# EAGLE schematic edi 1 (EAGLE 9.6.2)
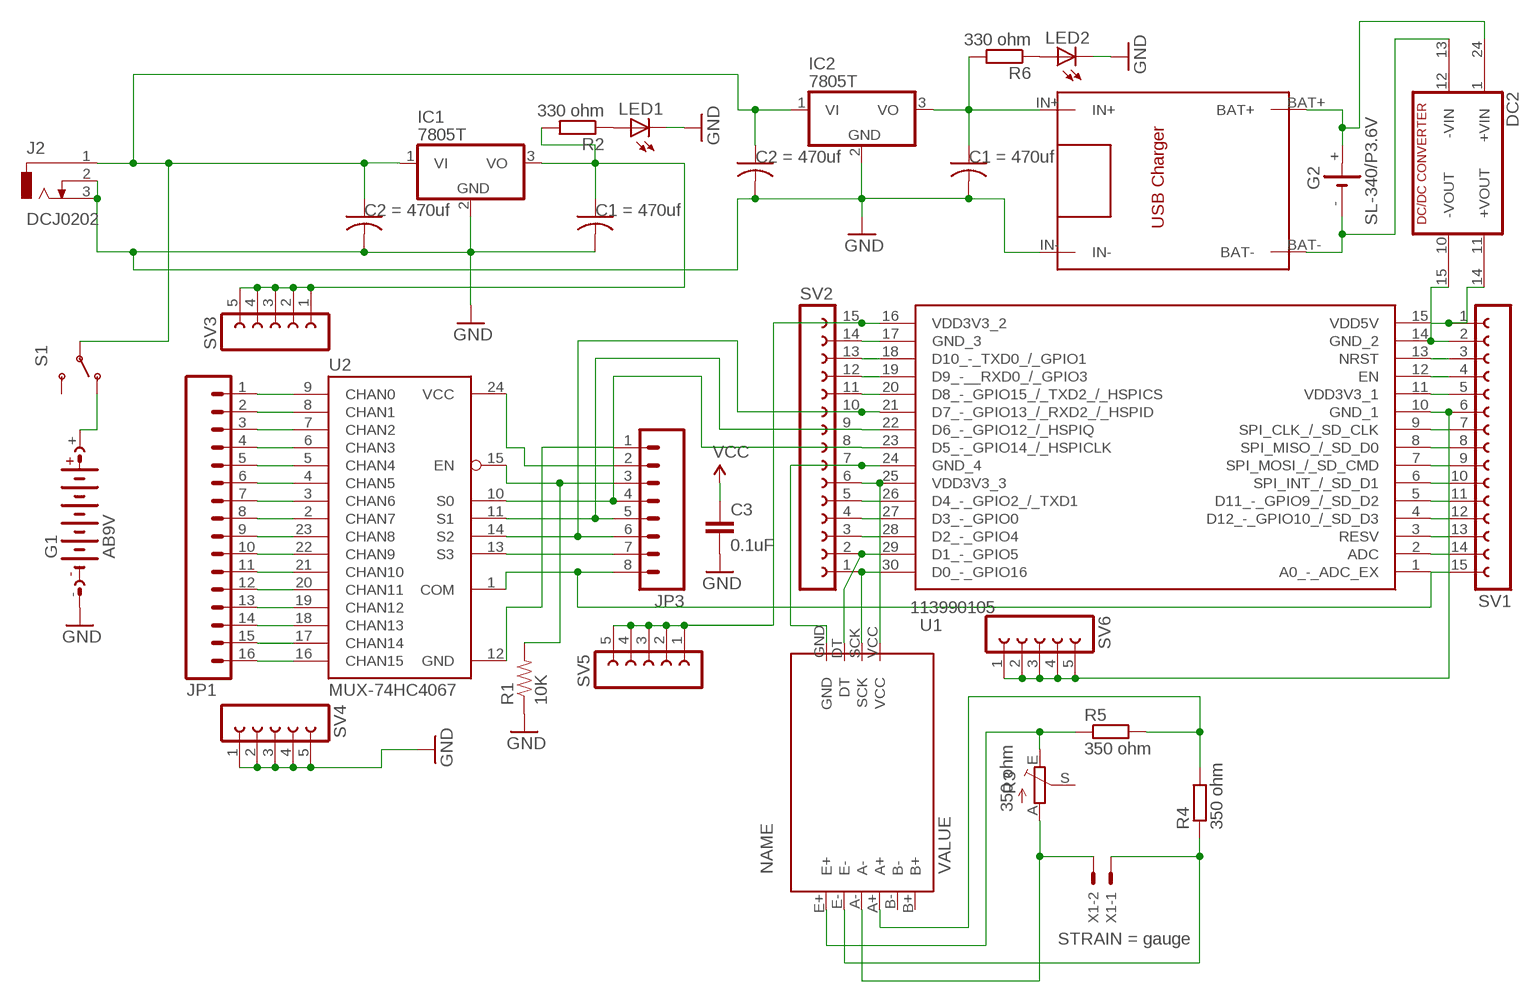
[diagram p0: schematic, sheet 1]

## Parts
C1  C-US025-024X044  [C025-024X044]
C2  C-US025-024X044  [C025-024X044]
C3  0.1uF  CAP0603  [0603]
C4  C-US025-024X044  [C025-024X044]
C5  C-US025-024X044  [C025-024X044]
DC2  DC213R  [CMK]
G1  AB9V  [AB9V]
G2  SL-340/P3.6V  [SL-340/P3.6V]
IC1  7805T  [TO220H]
IC2  7805T  [TO220H]
J2  DCJ0202  [DCJ0202]
JP1  M16PTH  [1X16]
JP3  M081X08  [1X08]
LED1  LEDLD260  [LD260]
LED2  LEDLD260  [LD260]
R1  10K  RESISTOR0603  [0603]
R2  330 ohm  R-EU_0204/5  [0204/5]
R3  350 ohm  TRIM_EU-RJ9W  [RJ9W]
R4  350 ohm  R-EU_0204/5  [0204/5]
R5  350 ohm  R-EU_0204/5  [0204/5]
R6  330 ohm  R-EU_0204/5  [0204/5]
S1  SWITCH-SPDTSMD  [SWITCH_SPDT_SMD]
SV1  FE15-1  [FE15]
SV2  FE15-1  [FE15]
SV3  FE05-1  [FE05-1]
SV4  FE05-1  [FE05-1]
SV5  FE05-1  [FE05-1]
SV6  FE05-1  [FE05-1]
U1  113990105  [113990105]
U2  MUX-74HC4067  MUX-74HC4067SMD  [SSOP24]
U$1  TP4056  [TP4056]
U$2  HX711A  [HX711]
X1  22-23-2021  [22-23-2021]

## Nets
C0: JP1.1 U2.9(CHAN0)
C1: JP1.2 U2.8(CHAN1)
C2: JP1.3 U2.7(CHAN2)
C3: JP1.4 U2.6(CHAN3)
C4: JP1.5 U2.5(CHAN4)
C5: JP1.6 U2.4(CHAN5)
C6: JP1.7 U2.3(CHAN6)
C7: JP1.8 U2.2(CHAN7)
C8: JP1.9 U2.23(CHAN8)
C9: JP1.10 U2.22(CHAN9)
C10: JP1.11 U2.21(CHAN10)
C11: JP1.12 U2.20(CHAN11)
C12: JP1.13 U2.19(CHAN12)
C13: JP1.14 U2.18(CHAN13)
C14: JP1.15 U2.17(CHAN14)
C15: JP1.16 U2.16(CHAN15)
EN: JP3.3 R1.2 U2.15(EN)
GND: C1.2 C2.2 C3.2 C4.2 C5.2 G1.- IC1.2(GND) IC2.2(GND) J2.2 J2.3 LED1.K(C) LED2.K(C) R1.1 SV4.1 SV4.2 SV4.3 SV4.4 SV4.5 U$1.IN-
N$1: SV2.15 SV5.1 SV5.2 SV5.3 SV5.4 SV5.5 U1.16(VDD3V3_2)
N$2: SV2.14 U1.17(GND_3)
N$3: SV2.13 U1.18(D10_-_TXD0_/_GPIO1)
N$4: SV2.12 U1.19(D9_-__RXD0_/_GPIO3)
N$5: SV2.11 U1.20(D8_-_GPIO15_/_TXD2_/_HSPICS)
N$6: G1.+ S1.1(O)
N$7: SV2.1 U1.30(D0_-_GPIO16) U$2.SCK
N$8: DC2.24(+VIN1) G2.+ U$1.BAT+
N$9: SV2.7 U1.24(GND_4) U$2.GND
N$10: SV1.6 SV6.1 SV6.2 SV6.3 SV6.4 SV6.5 U1.10(GND_1)
N$11: SV2.5 U1.26(D4_-_GPIO2_/_TXD1)
N$12: SV2.4 U1.27(D3_-_GPIO0)
N$13: SV2.3 U1.28(D2_-_GPIO4)
N$14: SV2.2 U1.29(D1_-_GPIO5) U$2.DT
N$15: C5.1 IC2.3(VO) R6.2 U$1.IN+
N$16: LED1.A R2.1
N$17: DC2.15(-VOUT1) SV1.2 U1.14(GND_2)
N$18: SV1.3 U1.13(NRST)
N$19: SV1.4 U1.12(EN)
N$20: SV1.5 U1.11(VDD3V3_1)
N$21: R4.2 R5.2 U$2.A+
N$22: SV1.7 U1.9(SPI_CLK_/_SD_CLK)
N$23: SV1.8 U1.8(SPI_MISO_/_SD_D0)
N$24: SV1.9 U1.7(SPI_MOSI_/_SD_CMD)
N$25: SV1.10 U1.6(SPI_INT_/_SD_D1)
N$26: SV1.11 U1.5(D11_-_GPIO9_/_SD_D2)
N$27: SV1.12 U1.4(D12_-_GPIO10_/_SD_D3)
N$28: SV1.13 U1.3(RESV)
N$29: SV1.14 U1.2(ADC)
N$30: DC2.14(+VOUT1) SV1.1 U1.15(VDD5V)
N$31: C1.1 C4.1 IC1.1(VI) IC2.1(VI) J2.1 S1.2(P)
N$32: C2.1 IC1.3(VO) R2.2 SV3.1 SV3.2 SV3.3 SV3.4 SV3.5
N$33: SV2.6 U1.25(VDD3V3_3) U$2.VCC
N$34: JP3.1 U2.12(GND)
N$35: R3.A U$2.A- X1.2
N$36: R4.1 U$2.E- X1.1
N$37: R3.E R5.1 U$2.E+
N$38: DC2.13(-VIN1) G2.- U$1.BAT-
N$43: LED2.A R6.1
S0: JP3.4 SV2.8 U1.23(D5_-_GPIO14_/_HSPICLK) U2.10(S0)
S1: JP3.5 SV2.9 U1.22(D6_-_GPIO12_/_HSPIQ) U2.11(S1)
S2: JP3.6 SV2.10 U1.21(D7_-_GPIO13_/_RXD2_/_HSPID) U2.14(S2)
S3: JP3.7 U2.13(S3)
SIG: JP3.8 SV1.15 U1.1(A0_-_ADC_EX) U2.1(COM)
VCC: C3.1 JP3.2 U2.24(VCC)
Unconnected: DC2.1(+VIN) DC2.10(-VOUT) DC2.11(+VOUT) DC2.12(-VIN) R3.S S1.3(S) U$2.B+ U$2.B-

## Library data of the parts
C1 C4 = rcl:C-US: CAPACITOR, American symbol; C2: 470uf; SPICEPREFIX: C
C2 C5 = rcl:C-US: CAPACITOR, American symbol; C1: 470uf; SPICEPREFIX: C
C3 = SparkFun:CAP: Capacitor Standard 0603 ceramic capacitor, and 0.1" leaded capacitor.
DC2 = dc-dc-converter:DC213R: DC-DC CONVERTER; OC_FARNELL: unknown; OC_NEWARK: unknown
G1 = battery:AB9V: 9-V BATTERY CLIP
G2 = battery:SL-340/P3.6V: LI BATTERY Sonnenschein
IC1 IC2 = linear:78*: Positive VOLTAGE REGULATOR Source: http://cache.national.com/ds/LM/LM78L05.pdf http://www.fairchildsemi.com/ds/LM/LM7805.pdf
J2 = con-jack:DCJ0202: DC POWER JACK Source: DCJ0202.pdf; OC_FARNELL: unknown; OC_NEWARK: unknown
JP1 = SparkFun-Connectors:M16: 1x16 .1" header
JP3 = SparkFun-Connectors:M08: Header 8 Standard 8-pin 0.1" header. Use with straight break away headers (SKU : PRT-00116), right angle break away headers (PRT-00553), swiss pins (PRT-00743), machine pins (PRT-00117), and female headers (PRT-00115).
LED1 LED2 = adafruit:LED: LED OSRAM: - CHIPLED LG R971, LG N971, LY N971, LG Q971, LY Q971, LO R971, LY R971 LH N974, LH R974 LS Q976, LO Q976, LY Q976 LO Q996 - Hyper CHIPLED LW Q18S LB Q993, LB Q99A, LB R99A - SideLED LS A670, LO A670, LY A670, LG A670, LP A670 LB A673, LV A673, LT A673, LW A673 LH A674 LY A675 LS A676, LA A676, LO A676, LY A676, LW A676 LS A679, LY A679, LG A679 - Hyper Micro SIDELED® LS Y876, LA Y876, LO Y876, LY Y876 LT Y87S - SmartLED LW L88C, LW L88S LB L89C, LB L89S, LG L890 LS L89K, LO L89K, LY L89K LS L896, LA L896, LO L896, LY L896 - TOPLED LS T670, LO T670, LY T670, LG T670, LP T670 LSG T670, LSP T670, LSY T670, LOP T670, LYG T670 LG T671, LOG T671, LSG T671 LB T673, LV T673, LT T673, LW T673 LH T674 LS T676, LA T676, LO T676, LY T676, LB T676, LH T676, LSB T676, LW T676 LB T67C, LV T67C, LT T67C, LS T67K, LO T67K, LY T67K, LW E67C LS E67B, LA E67B, LO E67B, LY E67B, LB E67C, LV E67C, LT E67C LW T67C LS T679, LY T679, LG T679 LS T770, LO T770, LY T770, LG T770, LP T770 LB T773, LV T773, LT T773, LW T773 LH T774 LS E675, LA E675, LY E675, LS T675 LS T776, LA T776, LO T776, LY T776, LB T776 LHGB T686 LT T68C, LB T68C - Hyper Mini TOPLED® LB M676 - Mini TOPLED Santana® LG M470 LS M47K, LO M47K, LY M47K Source: http://www.osram.convergy.de/
R1 = SparkFun:RESISTOR: Resistor Basic schematic elements and footprints for 0603, 1206, and PTH 1/10th watt (small) resistors.
R2 R4-R6 = rcl:R-EU_: RESISTOR, European symbol; SPICEPREFIX: R
R3 = pot:TRIM_EU-: POTENTIOMETER
S1 = SparkFun-Retired:SWITCH-SPDT: SPDT Switch Simple slide switch, Spark Fun Electronics SKU : COM-00102 DPDT SMT slide switch, AYZ0202, SWCH-08179
SV1 SV2 = con-lsta:FE15-1: FEMALE HEADER; OC_FARNELL: unknown; OC_NEWARK: unknown
SV3-SV6 = con-lsta:FE05-1: FEMALE HEADER; OC_FARNELL: unknown; OC_NEWARK: unknown
U1 = 113990105:113990105: NodeMCU DEVKIT V1.0 Source: Datasheet <https://www.seeedstudio.com/NodeMCU-v2-Lua-based-ESP8266-development-kit.html>; ARROW_PART_NUMBER: 113990105; ARROW_PRICE-STOCK: https://www.arrow.com/en/products/113990105/seeed-technology-limited?region=nac; DESCRIPTION: NodeMCU DEVKIT V1.0; HEIGHT: 7.35mm; MANUFACTURER_NAME: Seeed Studio; MANUFACTURER_PART_NUMBER: 113990105; MOUSER_PART_NUMBER: 713-113990105; MOUSER_PRICE-STOCK: https://www.mouser.co.uk/ProductDetail/Seeed-Studio/113990105?qs=SElPoaY2y5KMx8k1roAIKw%3D%3D
U2 = SparkFun:MUX-74HC4067
U$1 = TP4056 charging module:TP4056
U$2 = HX711:HX711
X1 = con-molex:22-23-2021: .100" (2.54mm) Center Header - 2 Pin; STRAIN: gauge